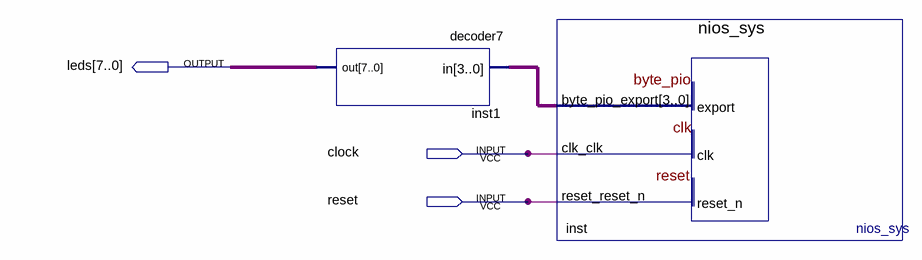
[diagram p0: schematic sheet]
// Quartus schematic nios_test.bdf as structural Verilog: 2 symbols, 3 pins
module nios_test (
  input  clock,
  input  reset,
  output [7:0] leds
);

  wire [3:0] inst_byte_pio_export;

  decoder7 inst1 (.in(inst_byte_pio_export), .out(leds));
  nios_sys inst (.clk_clk(clock), .reset_reset_n(reset), .byte_pio_export(inst_byte_pio_export));
endmodule
